# Altium schematic sheet Sheet1.SchDoc
size A4; SheetNumber: 1; SheetTotal: 3
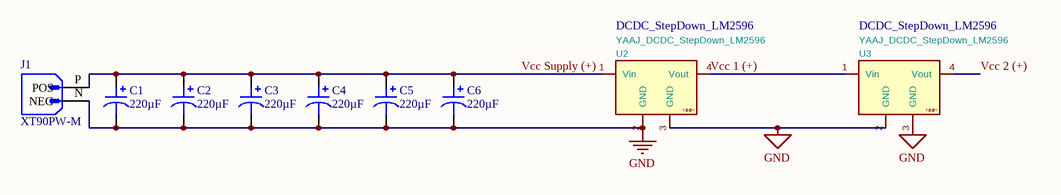
[diagram p0: Sheet1.SchDoc]

## Parts
C1  220µF  [CAP TH ALUM ELEC D10.00mm S5.00mm H20.00mm]
C2  220µF  [CAP TH ALUM ELEC D10.00mm S5.00mm H20.00mm]
C3  220µF  [CAP TH ALUM ELEC D10.00mm S5.00mm H20.00mm]
C4  220µF  [CAP TH ALUM ELEC D10.00mm S5.00mm H20.00mm]
C5  220µF  [CAP TH ALUM ELEC D10.00mm S5.00mm H20.00mm]
C6  220µF  [CAP TH ALUM ELEC D10.00mm S5.00mm H20.00mm]
J1  XT90PW-M  [AMASS_XT90PW-M]
U2  DCDC_StepDown_LM2596  value YAAJ_DCDC_StepDown_LM2596  [YAAJ_DCDC_StepDown_LM2596]
U3  DCDC_StepDown_LM2596  value YAAJ_DCDC_StepDown_LM2596  [YAAJ_DCDC_StepDown_LM2596]

## Nets
GND: C1.2 C2.2 C3.2 C4.2 C5.2 C6.2 J1.N(NEG) U2.2(GND) U2.3(GND) U3.2(GND) U3.3(GND)
Vcc 1 (+): U2.4(Vout) U3.1(Vin)
Vcc 2 (+): U3.4(Vout)
Vcc Supply (+): C1.1 C2.1 C3.1 C4.1 C5.1 C6.1 J1.P(POS) U2.1(Vin)

## Notes on the sheet
- (in symbol YAAJ_DCDC_StepDown_LM2596) Y@@V

## Library data of the parts
C1-C6 = UPW1J221MPD: DC Link Capacitor or Bulk Capacitor / CAP ALUM 220UF 20% 63V RADIAL; manufacturer: Nichicon; Impedance: 147 mOhms; Lifetime @ Temp.: 5000 Hrs @ 105°C; Polarization: Polar; Ripple Current @ High Frequency: 885mA @ 100kHz; Ripple Current @ Low Frequency: 575.25mA @ 120Hz; Part Number: UPW1J221MPD; Applications: General Purpose; Capacitance: 220µF; componentlink1description: Datasheet; componentlink1url: http://nichicon-us.com/english/products/pdfs/e-upw.pdf; componentlink2description: DigiKey Link; componentlink2url: http://digikey.com/product-detail/en/nichicon/UPW1J221MPD/493-1942-ND/589683; Device Package: Radial, Can; Height - Seated (Max): 0.787" (20.00mm); lastupdated: 02/09/2020 01:31:30; Lead Spacing: 0.197" (5.00mm); Lifecycle Status: Active; Minimum Order: 1; Mounting Type: Through Hole; Operating Temperature: -55°C ~ 105°C; Package / Case: Radial, Can; packaging: Bulk; partid: 12422; Part Status: Active; price: 0.65; series: UPW; Size / Dimension: 0.394" Dia (10.00mm); Supplier 1: DigiKey; Supplier Part Number 1: 493-1942-ND; Tolerance: ±20%; value: 220µF; Voltage - Rated: 63V
J1 = XT90PW-M: LiPo Battery 6s / ySocket; DC supply; XT90; male; PIN: 2; on PCBs; THT; Colour: yellow; MF: AMASS; SnapEDA_Link: https://www.snapeda.com/parts/XT90PW-M/AMASS/view-part/?ref=snap; Package: Package; Value: *; MP: XT90PW-M; Check_prices: https://www.snapeda.com/parts/XT90PW-M/AMASS/view-part/?ref=eda
U2 = YAAJ_DCDC_StepDown_LM2596: Buck Converver 15V
U3 = YAAJ_DCDC_StepDown_LM2596: Buck Converver 5V